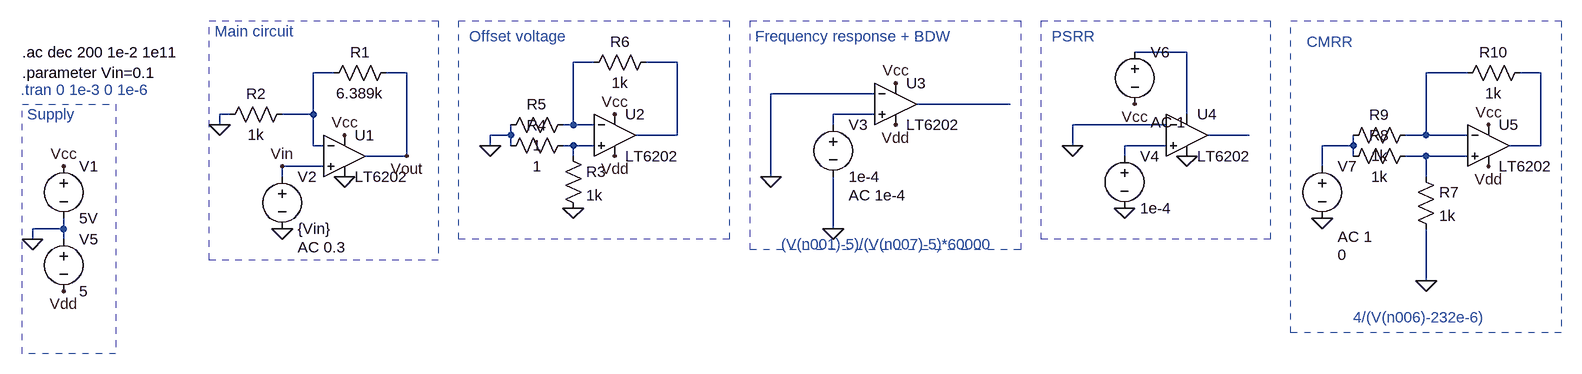
[diagram p0: schematic base.asc]
base.asc, the LTspice schematic file:
Version 4
SHEET 1 2116 680
WIRE 1536 32 1456 32
WIRE 624 48 592 48
WIRE 752 48 704 48
WIRE 224 64 192 64
WIRE 336 64 304 64
WIRE 1968 64 1904 64
WIRE 2080 64 2048 64
WIRE 1056 96 896 96
WIRE 1264 112 1120 112
WIRE 64 128 48 128
WIRE 192 128 192 64
WIRE 192 128 144 128
WIRE 1056 128 992 128
WIRE 1536 128 1536 32
WIRE 48 144 48 128
WIRE 592 144 592 48
WIRE 592 144 576 144
WIRE 624 144 592 144
WIRE 992 144 992 128
WIRE 1504 144 1360 144
WIRE 496 160 496 144
WIRE 496 160 464 160
WIRE 752 160 752 48
WIRE 752 160 688 160
WIRE 1632 160 1568 160
WIRE 1904 160 1904 64
WIRE 1904 160 1872 160
WIRE 1968 160 1904 160
WIRE 192 176 192 128
WIRE 208 176 192 176
WIRE 464 176 464 160
WIRE 496 176 496 160
WIRE 592 176 576 176
WIRE 624 176 592 176
WIRE 1360 176 1360 144
WIRE 1504 176 1440 176
WIRE 1792 176 1792 160
WIRE 1792 176 1744 176
WIRE 2080 176 2080 64
WIRE 2080 176 2032 176
WIRE 336 192 336 64
WIRE 336 192 272 192
WIRE 592 192 592 176
WIRE 1440 192 1440 176
WIRE 1792 192 1792 176
WIRE 1904 192 1872 192
WIRE 1968 192 1904 192
WIRE 208 208 144 208
WIRE 1744 208 1744 176
WIRE 144 224 144 208
WIRE 896 224 896 96
WIRE 1904 224 1904 192
WIRE -192 304 -192 288
WIRE -192 304 -240 304
WIRE 992 304 992 224
WIRE -240 320 -240 304
WIRE -192 320 -192 304
WIRE 1904 384 1904 304
FLAG -192 208 Vcc
FLAG 240 160 Vcc
FLAG 240 224 0
FLAG 144 304 0
FLAG 48 144 0
FLAG 336 192 Vout
FLAG 144 208 Vin
FLAG -240 320 0
FLAG -192 400 Vdd
FLAG 656 128 Vcc
FLAG 656 192 Vdd
FLAG 464 176 0
FLAG 592 272 0
FLAG 1088 80 Vcc
FLAG 896 224 0
FLAG 992 304 0
FLAG 1088 144 Vdd
FLAG 1440 272 0
FLAG 1536 192 0
FLAG 1360 176 0
FLAG 1456 112 Vcc
FLAG 2000 144 Vcc
FLAG 1904 384 0
FLAG 1744 288 0
FLAG 2000 208 Vdd
SYMBOL Opamps\\LT6202 240 192 R0
SYMATTR InstName U1
SYMBOL voltage -192 192 R0
WINDOW 123 0 0 Left 0
WINDOW 39 0 0 Left 0
SYMATTR InstName V1
SYMATTR Value 5V
SYMBOL res 320 48 R90
WINDOW 0 0 56 VBottom 2
WINDOW 3 32 56 VTop 2
SYMATTR InstName R1
SYMATTR Value 6.389k
SYMBOL res 48 144 R270
WINDOW 0 32 56 VTop 2
WINDOW 3 0 56 VBottom 2
SYMATTR InstName R2
SYMATTR Value 1k
SYMBOL voltage 144 208 R0
WINDOW 123 24 124 Left 2
WINDOW 39 0 0 Left 0
SYMATTR InstName V2
SYMATTR Value {Vin}
SYMATTR Value2 AC 0.3
SYMBOL voltage -192 304 R0
WINDOW 123 0 0 Left 0
WINDOW 39 0 0 Left 0
SYMATTR InstName V5
SYMATTR Value 5
SYMBOL Opamps\\LT6202 656 160 R0
SYMATTR InstName U2
SYMBOL res 576 176 R0
SYMATTR InstName R3
SYMATTR Value 1k
SYMBOL res 592 160 R90
WINDOW 0 0 56 VBottom 2
WINDOW 3 32 56 VTop 2
SYMATTR InstName R4
SYMATTR Value 1
SYMBOL res 592 128 R90
WINDOW 0 0 56 VBottom 2
WINDOW 3 32 56 VTop 2
SYMATTR InstName R5
SYMATTR Value 1
SYMBOL res 720 32 R90
WINDOW 0 0 56 VBottom 2
WINDOW 3 32 56 VTop 2
SYMATTR InstName R6
SYMATTR Value 1k
SYMBOL Opamps\\LT6202 1088 112 R0
SYMATTR InstName U3
SYMBOL voltage 992 128 R0
WINDOW 123 24 124 Left 2
WINDOW 39 0 0 Left 0
SYMATTR InstName V3
SYMATTR Value 1e-4
SYMATTR Value2 AC 1e-4
SYMBOL Opamps\\LT6202 1536 160 R0
SYMATTR InstName U4
SYMBOL voltage 1440 176 R0
WINDOW 123 24 124 Left 2
WINDOW 39 0 0 Left 0
SYMATTR InstName V4
SYMATTR Value 1e-4
SYMBOL voltage 1456 16 R0
WINDOW 123 24 124 Left 2
WINDOW 39 0 0 Left 0
SYMATTR InstName V6
SYMATTR Value ""
SYMATTR Value2 AC 1
SYMBOL Opamps\\LT6202 2000 176 R0
SYMATTR InstName U5
SYMBOL res 1888 208 R0
SYMATTR InstName R7
SYMATTR Value 1k
SYMBOL res 1888 176 R90
WINDOW 0 0 56 VBottom 2
WINDOW 3 32 56 VTop 2
SYMATTR InstName R8
SYMATTR Value 1k
SYMBOL res 1888 144 R90
WINDOW 0 0 56 VBottom 2
WINDOW 3 32 56 VTop 2
SYMATTR InstName R9
SYMATTR Value 1k
SYMBOL res 2064 48 R90
WINDOW 0 0 56 VBottom 2
WINDOW 3 32 56 VTop 2
SYMATTR InstName R10
SYMATTR Value 1k
SYMBOL voltage 1744 192 R0
WINDOW 3 24 152 Left 2
WINDOW 123 24 124 Left 2
WINDOW 39 0 0 Left 0
SYMATTR InstName V7
SYMATTR Value 0
SYMATTR Value2 AC 1
TEXT -256 64 Left 2 !.parameter Vin=0.1
TEXT -258 90 Left 2 ;.tran 0 1e-3 0 1e-6
TEXT -248 128 Left 2 ;Supply
TEXT 40 0 Left 2 ;Main circuit
TEXT 432 8 Left 2 ;Offset voltage
TEXT -256 32 Left 2 !.ac dec 200 1e-2 1e11
TEXT 872 8 Left 2 ;Frequency response + BDW
TEXT 912 328 Left 2 ;(V(n001)-5)/(V(n007)-5)*60000
TEXT 1328 8 Left 2 ;PSRR
TEXT 1792 440 Left 2 ;4/(V(n006)-232e-6)
TEXT 1720 16 Left 2 ;CMRR
RECTANGLE Normal -112 496 -256 112 3
RECTANGLE Normal 384 352 32 -16 3
RECTANGLE Normal 832 320 416 -16 3
RECTANGLE Normal 1280 336 864 -16 3
RECTANGLE Normal 1664 320 1312 -16 3
RECTANGLE Normal 2112 464 1696 -16 3

The netlist it stands for:
* base.asc
* U1: LT6202 (symbol Opamps\LT6202 not available, pins judged from their places): In+=Vin In-=N004 V+=Vcc V-=0 OUT=Vout
V1 Vcc 0 5V
R1 Vout N004 6.389k
R2 0 N004 1k
V2 Vin 0 {Vin} AC 0.3
V5 0 Vdd 5
* U2: LT6202 (symbol Opamps\LT6202 not available, pins judged from their places): In+=N010 In-=N002 V+=Vcc V-=Vdd OUT=N003
R3 N010 0 1k
R4 N010 0 1
R5 N002 0 1
R6 N003 N002 1k
* U3: LT6202 (symbol Opamps\LT6202 not available, pins judged from their places): In+=N008 In-=0 V+=Vcc V-=Vdd OUT=N007
V3 N008 0 1e-4 AC 1e-4
* U4: LT6202 (symbol Opamps\LT6202 not available, pins judged from their places): In+=N011 In-=0 V+=N001 V-=0 OUT=N009
V4 N011 0 1e-4
V6 N001 Vcc AC 1
* U5: LT6202 (symbol Opamps\LT6202 not available, pins judged from their places): In+=N013 In-=N005 V+=Vcc V-=Vdd OUT=N006
R7 N013 0 1k
R8 N013 N012 1k
R9 N005 N012 1k
R10 N006 N005 1k
V7 N012 0 0 AC 1
.parameter Vin=0.1
* .tran 0 1e-3 0 1e-6
* Supply
* Main circuit
* Offset voltage
.ac dec 200 1e-2 1e11
* Frequency response + BDW
* (V(n001)-5)/(V(n007)-5)*60000
* PSRR
* 4/(V(n006)-232e-6)
* CMRR
.backanno
.end